# EAGLE schematic eTapper1main1 (EAGLE 8.2.2)
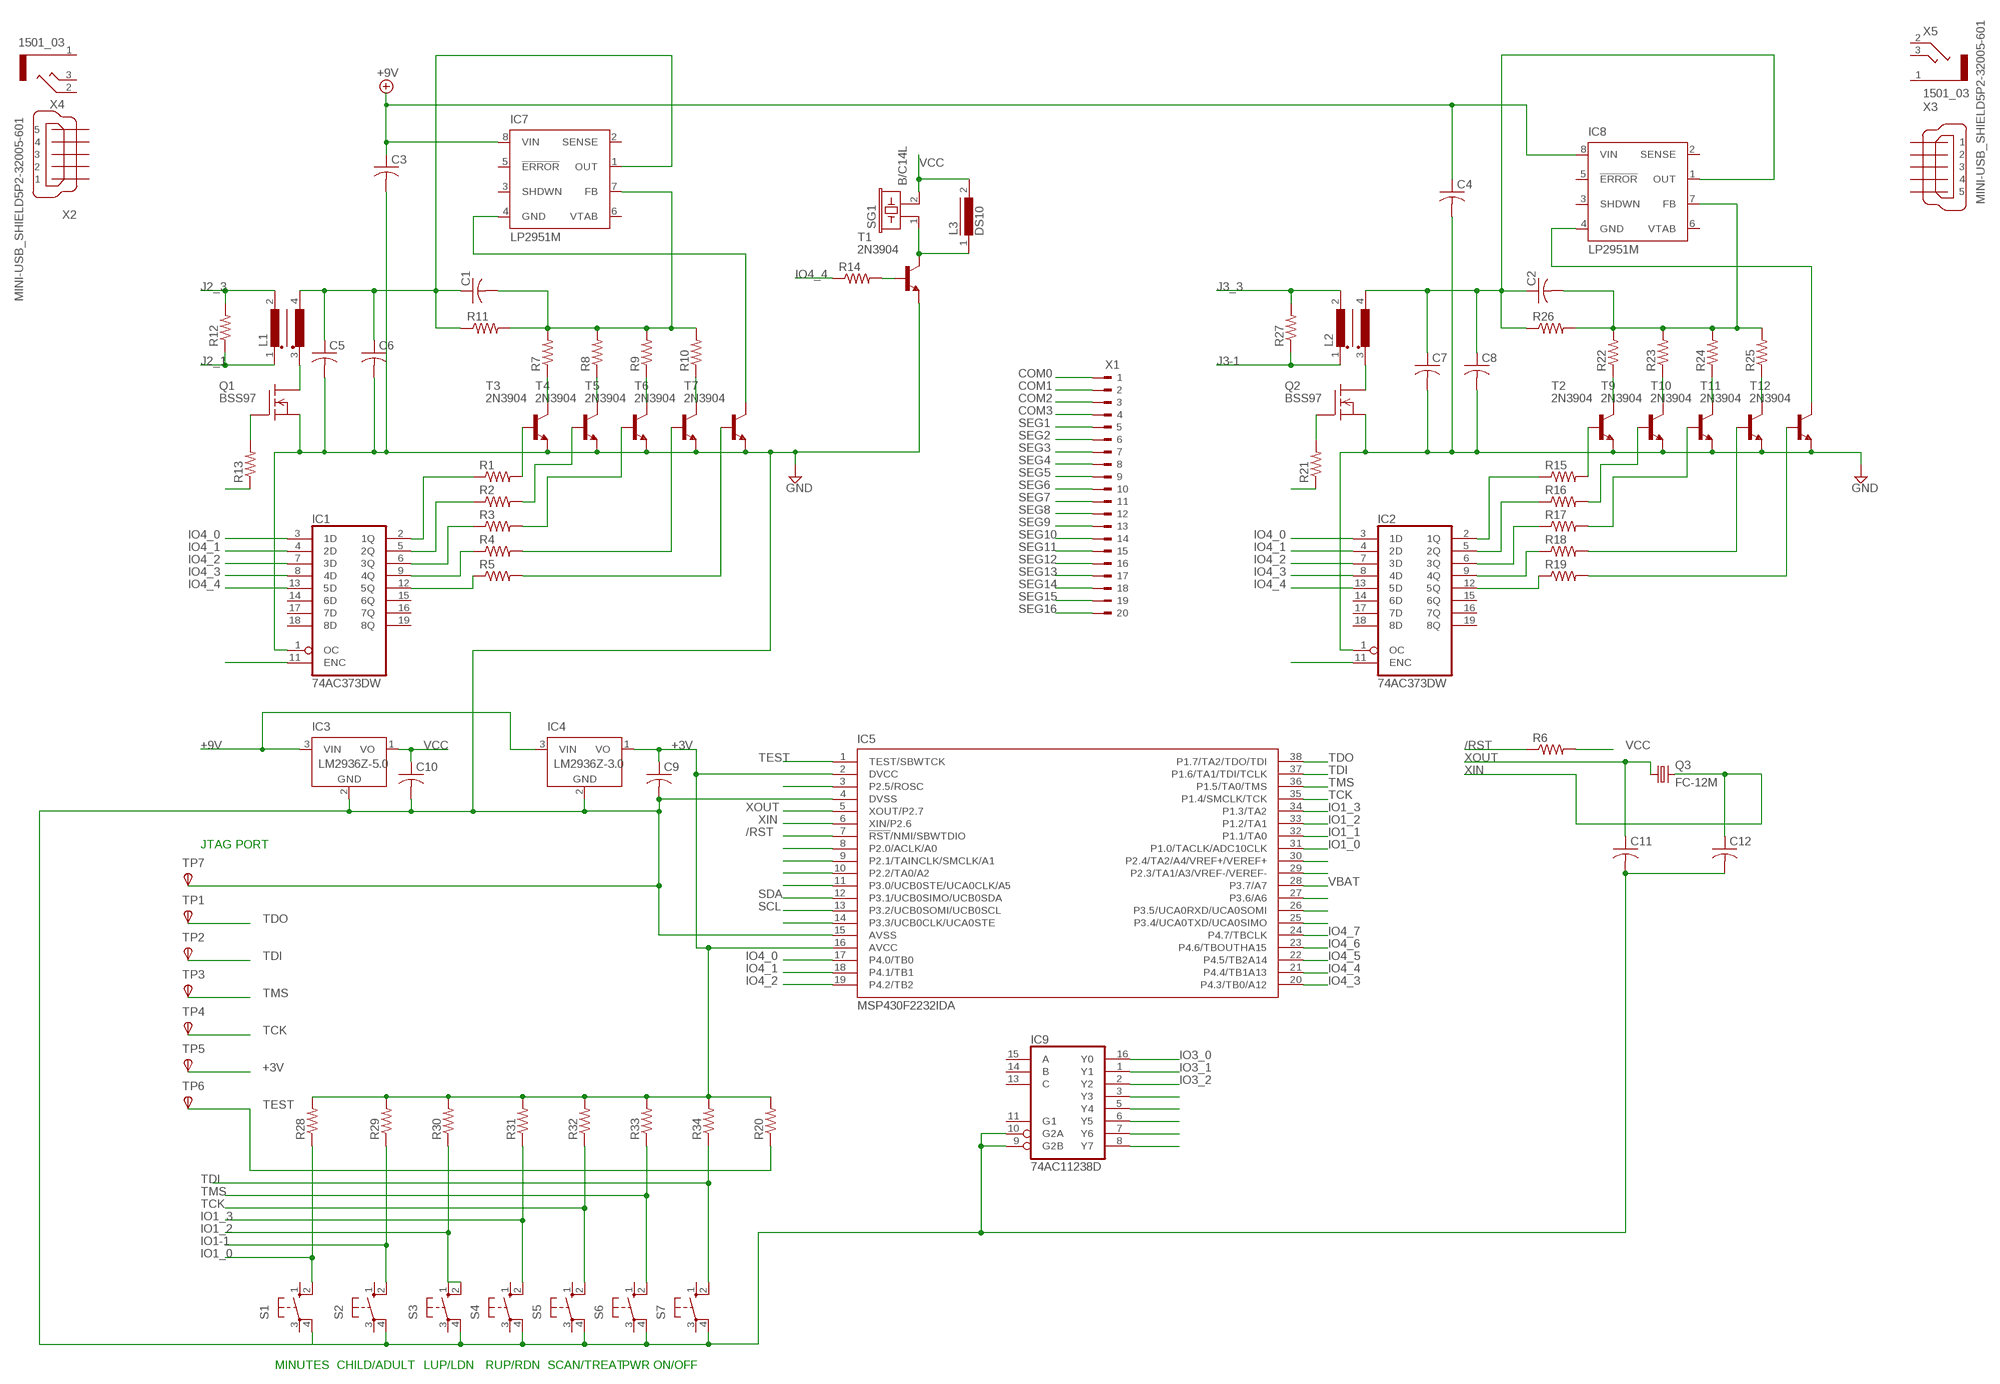
[diagram p0: schematic, sheet 1]

## Parts
C1  C-USC0805  [C0805]
C2  C-USC0805  [C0805]
C3  C-USC0805  [C0805]
C4  C-USC0805  [C0805]
C5  C-USC0805  [C0805]
C6  C-USC0805  [C0805]
C7  C-USC0805  [C0805]
C8  C-USC0805  [C0805]
C9  C-USC0805  [C0805]
C10  C-USC0805  [C0805]
C11  C-USC0805  [C0805]
C12  C-USC0805  [C0805]
IC1  74AC373DW  [SO20W]
IC2  74AC373DW  [SO20W]
IC3  LM2936Z-5.0  [TO92]
IC4  LM2936Z-3.0  [TO92]
IC5  MSP430F2232IDA  [TSSOP38_R-PDSO-G38-DA]
IC7  LP2951M  [SO08]
IC8  LP2951M  [SO08]
IC9  74AC11238D  [SO16]
L1  SK9-2  [SK9]
L2  SK9-2  [SK9]
L3  DS10  [DS10]
Q1  BSS97  [TO202]
Q2  BSS97  [TO202]
Q3  FC-12M  [FC-12M]
R1  R-US_R0402  [R0402]
R2  R-US_R0402  [R0402]
R3  R-US_R0402  [R0402]
R4  R-US_R0402  [R0402]
R5  R-US_R0402  [R0402]
R6  R-US_R0402  [R0402]
R7  R-US_R0402  [R0402]
R8  R-US_R0402  [R0402]
R9  R-US_R0402  [R0402]
R10  R-US_R0402  [R0402]
R11  R-US_R0402  [R0402]
R12  R-US_R0402  [R0402]
R13  R-US_R0402  [R0402]
R14  R-US_R0402  [R0402]
R15  R-US_R0402  [R0402]
R16  R-US_R0402  [R0402]
R17  R-US_R0402  [R0402]
R18  R-US_R0402  [R0402]
R19  R-US_R0402  [R0402]
R20  R-US_R0402  [R0402]
R21  R-US_R0402  [R0402]
R22  R-US_R0402  [R0402]
R23  R-US_R0402  [R0402]
R24  R-US_R0402  [R0402]
R25  R-US_R0402  [R0402]
R26  R-US_R0402  [R0402]
R27  R-US_R0402  [R0402]
R28  R-US_R0402  [R0402]
R29  R-US_R0402  [R0402]
R30  R-US_R0402  [R0402]
R31  R-US_R0402  [R0402]
R32  R-US_R0402  [R0402]
R33  R-US_R0402  [R0402]
R34  R-US_R0402  [R0402]
S1  10-XX  [B3F-10XX]
S2  10-XX  [B3F-10XX]
S3  10-XX  [B3F-10XX]
S4  10-XX  [B3F-10XX]
S5  10-XX  [B3F-10XX]
S6  10-XX  [B3F-10XX]
S7  10-XX  [B3F-10XX]
SG1  B/C14L  [B/C14L]
T1  2N3904  [TO92]
T2  2N3904  [TO92]
T3  2N3904  [TO92]
T4  2N3904  [TO92]
T5  2N3904  [TO92]
T6  2N3904  [TO92]
T7  2N3904  [TO92]
T9  2N3904  [TO92]
T10  2N3904  [TO92]
T11  2N3904  [TO92]
T12  2N3904  [TO92]
TP1  TPSTP06R  [TP06R]
TP2  TPSTP06R  [TP06R]
TP3  TPSTP06R  [TP06R]
TP4  TPSTP06R  [TP06R]
TP5  TPSTP06R  [TP06R]
TP6  TPSTP06R  [TP06R]
TP7  TPSTP06R  [TP06R]
X1  110-20  [110-20]
X2  MINI-USB_SHIELD5P2-32005-601  [32005-601]
X3  MINI-USB_SHIELD5P2-32005-601  [32005-601]
X4  1501_03  [1501_03]
X5  1501_03  [1501_03]

## Nets
+3V: C9.1 IC4.1(VO) IC5.2(DVCC) IC5.16(AVCC) R20.2 R28.2 R29.2 R30.2 R31.2 R32.2 R33.2 R34.2 TP5.TP(PP)
+9V: C3.1 C4.1 IC3.3(VIN) IC4.3(VIN) IC7.8(VIN) IC8.8(VIN)
/RST: IC5.7(!RST!/NMI/SBWTDIO) R6.1
COM0: X1.1
COM1: X1.2
COM2: X1.3
COM3: X1.4
GND: C3.2 C4.2 C5.2 C6.2 C7.2 C8.2 C9.2 C10.2 IC3.2(GND) IC4.2(GND) IC5.4(DVSS) IC5.15(AVSS) Q1.1(S) Q2.1(S) S1.4(P1) T1.3(E) T2.3(E) T3.3(E) T4.3(E) T5.3(E) T6.3(E) T7.3(E) T9.3(E) T10.3(E) T11.3(E) T12.3(E) TP7.TP(PP)
IO1-1: R29.1 S2.2(S1)
IO1_0: IC5.31(P1.0/TACLK/ADC10CLK) R28.1 S1.2(S1)
IO1_1: IC5.32(P1.1/TA0)
IO1_2: IC5.33(P1.2/TA1) R30.1 S3.2(S1)
IO1_3: IC5.34(P1.3/TA2) R31.1 S4.2(S1)
IO3_0: IC9.16(Y0)
IO3_1: IC9.1(Y1)
IO3_2: IC9.2(Y2)
IO4_0: IC1.3(1D) IC2.3(1D) IC5.17(P4.0/TB0)
IO4_1: IC1.4(2D) IC2.4(2D) IC5.18(P4.1/TB1)
IO4_2: IC1.7(3D) IC2.7(3D) IC5.19(P4.2/TB2)
IO4_3: IC1.8(4D) IC2.8(4D) IC5.20(P4.3/TB0/A12)
IO4_4: IC1.13(5D) IC2.13(5D) IC5.21(P4.4/TB1A13) R14.1
IO4_5: IC5.22(P4.5/TB2A14)
IO4_6: IC5.23(P4.6/TBOUTHA15)
IO4_7: IC5.24(P4.7/TBCLK)
J2_1: L1.1(W1A) R12.1
J2_3: L1.2(W1E) R12.2
J3-1: L2.1(W1A) R27.1
J3_3: L2.2(W1E) R27.2
N$1: IC1.2(1Q) R1.1
N$2: IC1.5(2Q) R2.1
N$3: IC1.6(3Q) R3.1
N$4: IC1.9(4Q) R4.1
N$5: IC1.12(5Q) R5.1
N$6: L3.1 SG1.1 T1.1(C)
N$7: R4.2 T6.2(B)
N$8: R5.2 T7.2(B)
N$10: R7.1 T3.1(C)
N$11: R8.1 T4.1(C)
N$12: R9.1 T5.1(C)
N$13: R1.2 T3.2(B)
N$14: R2.2 T4.2(B)
N$15: R3.2 T5.2(B)
N$16: R10.1 T6.1(C)
N$17: C1.2 IC7.7(FB) R7.2 R8.2 R9.2 R10.2 R11.2
N$18: C1.1 C5.1 C6.1 IC7.1(OUT) L1.4(W2E) R11.1
N$19: L1.3(W2A) Q1.2(D)
N$20: IC2.2(1Q) R15.1
N$21: Q1.3(G) R13.2
N$22: R14.2 T1.2(B)
N$24: IC2.5(2Q) R16.1
N$25: IC2.6(3Q) R17.1
N$26: IC2.9(4Q) R18.1
N$27: IC2.12(5Q) R19.1
N$29: R15.2 T2.2(B)
N$30: R16.2 T9.2(B)
N$31: R17.2 T10.2(B)
N$32: R18.2 T11.2(B)
N$33: R19.2 T12.2(B)
N$35: R22.1 T2.1(C)
N$36: R23.1 T9.1(C)
N$37: R24.1 T10.1(C)
N$38: R25.1 T11.1(C)
N$39: C2.2 IC8.7(FB) R22.2 R23.2 R24.2 R25.2 R26.2
N$40: C2.1 C7.1 C8.1 IC8.1(OUT) L2.4(W2E) R26.1
N$41: L2.3(W2A) Q2.2(D)
N$42: Q2.3(G) R21.2
N$45: IC7.4(GND) T7.1(C)
N$47: IC8.4(GND) T12.1(C)
N$51: R21.1
N$52: R13.1
N$53: IC2.11(ENC)
N$54: IC1.11(ENC)
N$55: IC5.3(P2.5/ROSC)
N$56: IC5.9(P2.1/TAINCLK/SMCLK/A1)
N$57: IC9.3(Y3)
N$58: C11.2 C12.2 IC9.9(G2B) IC9.10(G2A) S2.4(P1) S3.4(P1) S4.4(P1) S5.4(P1) S6.4(P1) S7.4(P1)
N$59: IC9.5(Y4)
N$60: IC9.6(Y5)
N$61: IC9.7(Y6)
N$62: IC9.8(Y7)
N$63: IC5.10(P2.2/TA0/A2)
N$64: IC5.30(P2.4/TA2/A4/VREF+/VEREF+)
N$65: IC5.29(P2.3/TA1/A3/VREF-/VEREF-)
N$66: IC5.11(P3.0/UCB0STE/UCA0CLK/A5)
N$67: IC5.14(P3.3/UCB0CLK/UCA0STE)
N$68: IC5.25(P3.4/UCA0TXD/UCA0SIMO)
N$69: IC5.26(P3.5/UCA0RXD/UCA0SOMI)
N$70: IC5.27(P3.6/A6)
N$72: IC5.8(P2.0/ACLK/A0)
SCL: IC5.13(P3.2/UCB0SOMI/UCB0SCL)
SDA: IC5.12(P3.1/UCB0SIMO/UCB0SDA)
SEG1: X1.5
SEG2: X1.6
SEG3: X1.7
SEG4: X1.8
SEG5: X1.9
SEG6: X1.10
SEG7: X1.11
SEG8: X1.12
SEG9: X1.13
SEG10: X1.14
SEG11: X1.15
SEG12: X1.16
SEG13: X1.17
SEG14: X1.18
SEG15: X1.19
SEG16: X1.20
TCK: IC5.35(P1.4/SMCLK/TCK) R32.1 S5.2(S1) TP4.TP(PP)
TDI: IC5.37(P1.6/TA1/TDI/TCLK) R34.1 S7.2(S1) TP2.TP(PP)
TDO: IC5.38(P1.7/TA2/TDO/TDI) TP1.TP(PP)
TEST: IC5.1(TEST/SBWTCK) R20.1 TP6.TP(PP)
TMS: IC5.36(P1.5/TA0/TMS) R33.1 S6.2(S1) TP3.TP(PP)
VBAT: IC5.28(P3.7/A7)
VCC: C10.1 IC3.1(VO) L3.2 R6.2 SG1.2
XIN: C12.1 IC5.6(XIN/P2.6) Q3.2
XOUT: C11.1 IC5.5(XOUT/P2.7) Q3.1
Unconnected: IC1.1(OC) IC1.14(6D) IC1.15(6Q) IC1.16(7Q) IC1.17(7D) IC1.18(8D) IC1.19(8Q) IC2.1(OC) IC2.14(6D) IC2.15(6Q) IC2.16(7Q) IC2.17(7D) IC2.18(8D) IC2.19(8Q) IC7.2(SENSE) IC7.3(SHDWN) IC7.5(!ERROR) IC7.6(VTAB) IC8.2(SENSE) IC8.3(SHDWN) IC8.5(!ERROR) IC8.6(VTAB) IC9.11(G1) IC9.13(C) IC9.14(B) IC9.15(A) S1.1(S) S1.3(P) S2.1(S) S2.3(P) S3.1(S) S3.3(P) S4.1(S) S4.3(P) S5.1(S) S5.3(P) S6.1(S) S6.3(P) S7.1(S) S7.3(P) X2.1 X2.2 X2.3 X2.4 X2.5 X2.M1(S1) X2.M2(S2) X3.1 X3.2 X3.3 X3.4 X3.5 X3.M1(S1) X3.M2(S2) X4.1 X4.2 X4.3 X5.1 X5.2 X5.3

## Notes on the sheet
- JTAG PORT
- MINUTES | CHILD/ADULT | LUP/LDN | RUP/RDN | SCAN/TREAT | PWR ON/OFF

## Power pins joined to a net without a drawn wire
GND: IC1.10(GND) IC2.10(GND) IC9.4(GND)
VCC: IC1.20(VCC) IC2.20(VCC) IC9.12(VCC)

## Library data of the parts
C1-C12 = rcl:C-US: CAPACITOR, American symbol
IC1 IC2 = 74xx-eu:74*373: Octal D type transparent LATCH, edge triggered
IC3 = national-semiconductor:LM2936?*: Ultra-Low Quiescent Current LDO Voltage Regulator Source: Data sheet <http://www.national.com/ds/LM/LM2936.pdf>; MF: NATIONAL SEMICONDUCTOR; MPN: LM2936Z-5.0/NOPB; OC_FARNELL: 1150143; OC_NEWARK: 41K4533
IC4 = national-semiconductor:LM2936?*: Ultra-Low Quiescent Current LDO Voltage Regulator Source: Data sheet <http://www.national.com/ds/LM/LM2936.pdf>; MF: NATIONAL SEMICONDUCTOR; MPN: LM2936Z-3.0/NOPB; OC_FARNELL: 1312709; OC_NEWARK: 41K4531
IC5 = texas:MSP430F22*2IDA: MIXED SIGNAL MICROCONTROLLER Source: http://focus.ti.com/lit/ds/symlink/msp430f2274.pdf; MPN: MSP430F2232IDA; OC_FARNELL: 1610178; OC_NEWARK: 28M6312
IC7 IC8 = national-semiconductor:LP2951: Adjustable Micropower Voltage Regulator Source: http://www.national.com/ds/LP/LP2950.pdf; MF: FAIRCHILD SEMICONDUCTOR; MPN: LP2951CM; OC_FARNELL: 9488561; OC_NEWARK: 78K6014
IC9 = 74ac-logic:74AC11238: 3 to 8 line DECODER/DEMULTIPLEXER
L1 L2 = trafo-siemens:SK9-2: TRANSFORMER; OC_FARNELL: unknown; OC_NEWARK: unknown
L3 = inductors:DS10: INDUCTOR
Q1 Q2 = transistor-fet:BSS97: N-Channel Enhancement MOSFET 200V; 1.5A; 1,6Ohm
Q3 = crystal:FC-12M: kHz RANGE CRYSTAL UNIT LOW PROFILE SMD Source: Epson Toyocom FC-12M.pdf
R1-R34 = resistor:R-US_: RESISTOR, American symbol
S1-S7 = switch-omron:10-XX: OMRON SWITCH; MPN: B3F-1000; OC_FARNELL: 176432; OC_NEWARK: 36M3542
SG1 = buzzer:B/C14L: BUZZER Source: Buerklin; OC_FARNELL: unknown; OC_NEWARK: unknown
T1-T7 T9-T12 = transistor-neu-to92:2N3904: NPN TRANSISTOR
TP1-TP7 = testpad:TPS: TEST PIN
X1 = con-weidmueller-sl35:110-20: WEIDMUELLER CLAMP CONNECTOR; OC_FARNELL: unknown; OC_NEWARK: unknown
X2 X3 = con-cypressindustries:MINI-USB_SHIELD5P2-: MINI USB-B R/A DIP 5pol. Source: www.cypressindustries.com; OC_FARNELL: unknown; OC_NEWARK: unknown
X4 X5 = con-lumberg:1501_03: Klinkensteckverbinder nach JISC 6560, 2,5 mm Jack connectors according to JISC 6560, 2.5 mm Source: http://www.lumberg.com/Produkte/PDFs/1501_03.pdf; OC_FARNELL: 1200127; OC_NEWARK: unknown

## Module LP2951
Ports: 

### Library data of the parts